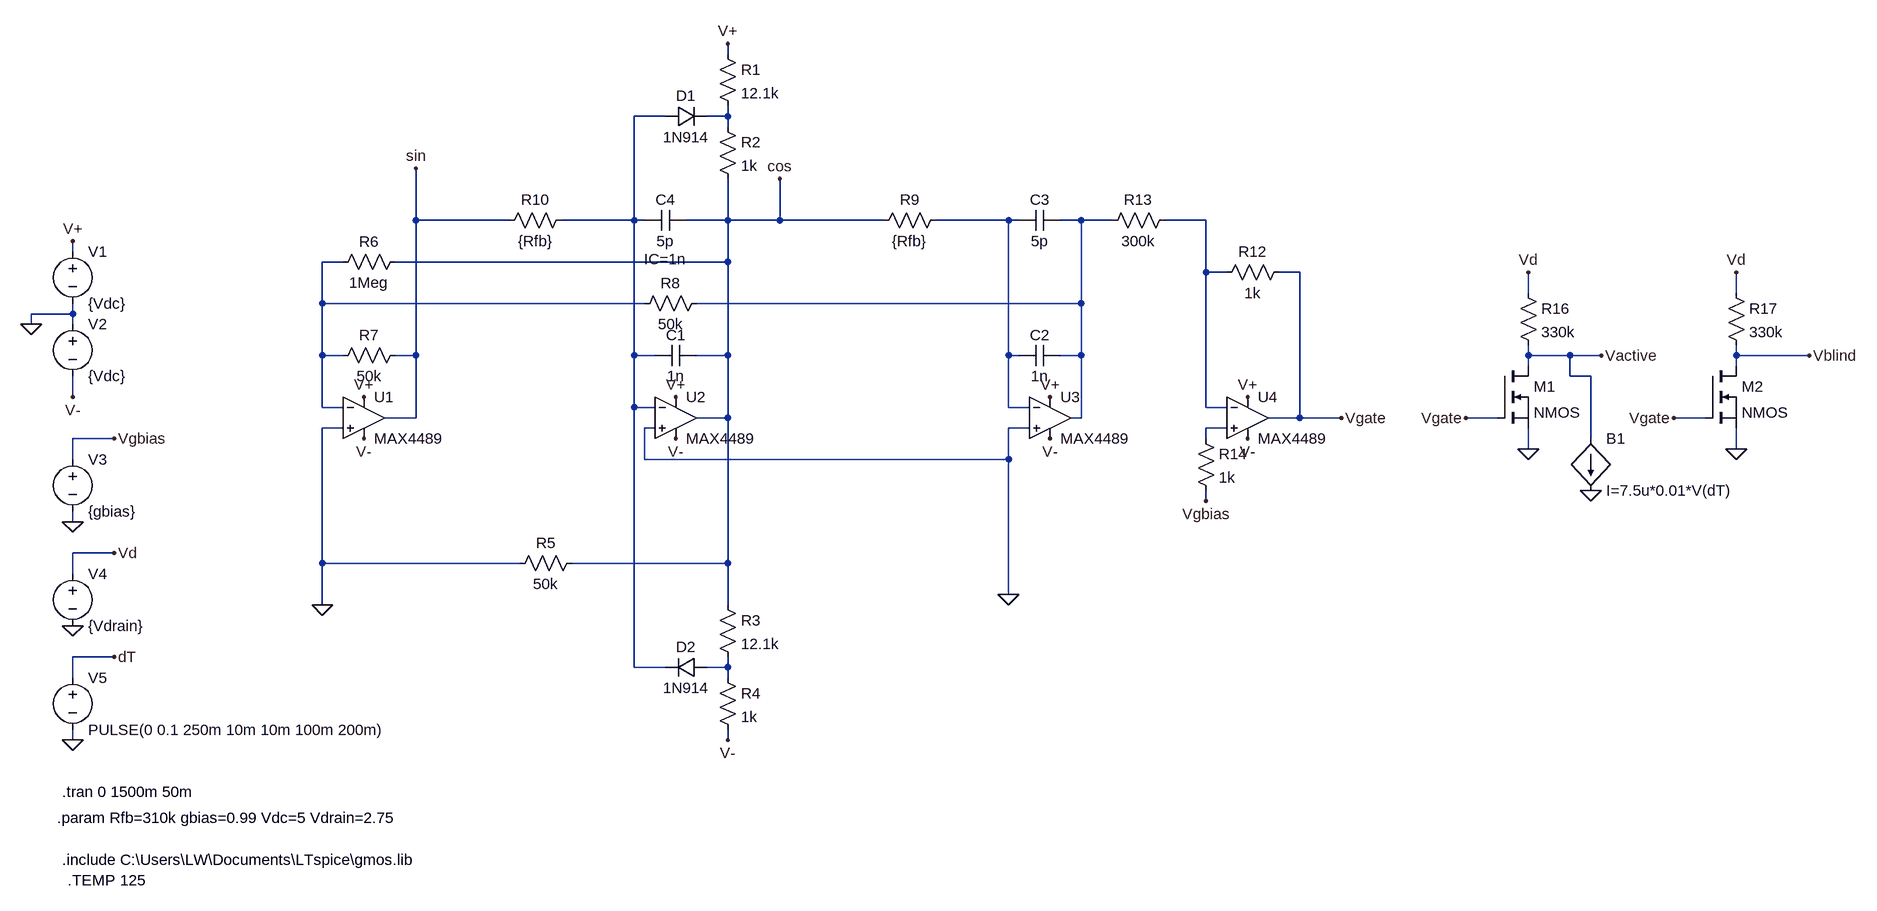
[diagram p0: schematic quadrature_oscillator.asc]
quadrature_oscillator.asc, the LTspice schematic file:
Version 4.1
SHEET 1 2960 2260
WIRE 208 -80 208 -96
WIRE 112 16 64 16
WIRE 208 16 208 0
WIRE 208 16 176 16
WIRE 208 32 208 16
WIRE -272 176 -272 96
WIRE -128 176 -272 176
WIRE 64 176 64 16
WIRE 64 176 -48 176
WIRE 80 176 64 176
WIRE 208 176 208 112
WIRE 208 176 144 176
WIRE 288 176 288 112
WIRE 288 176 208 176
WIRE 448 176 288 176
WIRE 640 176 528 176
WIRE 656 176 640 176
WIRE 752 176 720 176
WIRE 800 176 752 176
WIRE 944 176 880 176
WIRE -800 224 -800 208
WIRE -384 240 -416 240
WIRE 208 240 208 176
WIRE 208 240 -304 240
WIRE 944 256 944 176
WIRE 976 256 944 256
WIRE 1088 256 1056 256
WIRE 1440 288 1440 256
WIRE 1760 288 1760 256
WIRE -416 304 -416 240
WIRE 80 304 -416 304
WIRE 752 304 752 176
WIRE 752 304 160 304
WIRE -800 320 -800 304
WIRE -800 320 -864 320
WIRE -864 336 -864 320
WIRE -800 336 -800 320
WIRE -416 384 -416 304
WIRE -384 384 -416 384
WIRE -272 384 -272 176
WIRE -272 384 -304 384
WIRE 64 384 64 176
WIRE 96 384 64 384
WIRE 208 384 208 240
WIRE 208 384 160 384
WIRE 640 384 640 176
WIRE 656 384 640 384
WIRE 752 384 752 304
WIRE 752 384 720 384
WIRE 1440 384 1440 368
WIRE 1504 384 1440 384
WIRE 1552 384 1504 384
WIRE 1760 384 1760 368
WIRE 1872 384 1760 384
WIRE 1440 400 1440 384
WIRE 1760 400 1760 384
WIRE 1504 416 1504 384
WIRE 1536 416 1504 416
WIRE -800 448 -800 416
WIRE -416 464 -416 384
WIRE -384 464 -416 464
WIRE 64 464 64 384
WIRE 96 464 64 464
WIRE 640 464 640 384
WIRE 672 464 640 464
WIRE 944 464 944 256
WIRE 976 464 944 464
WIRE -272 480 -272 384
WIRE -272 480 -320 480
WIRE 208 480 208 384
WIRE 208 480 160 480
WIRE 752 480 752 384
WIRE 752 480 736 480
WIRE 1088 480 1088 256
WIRE 1088 480 1040 480
WIRE 1152 480 1088 480
WIRE 1392 480 1344 480
WIRE 1712 480 1664 480
WIRE -384 496 -416 496
WIRE 96 496 80 496
WIRE 672 496 640 496
WIRE 976 496 944 496
WIRE -736 512 -800 512
WIRE 944 512 944 496
WIRE 1536 512 1536 416
WIRE 1440 528 1440 496
WIRE 1760 528 1760 496
WIRE -800 544 -800 512
WIRE 80 544 80 496
WIRE 640 544 640 496
WIRE 640 544 80 544
WIRE 944 608 944 592
WIRE -800 640 -800 624
WIRE -736 688 -800 688
WIRE -416 704 -416 496
WIRE -112 704 -416 704
WIRE 208 704 208 480
WIRE 208 704 -32 704
WIRE -800 720 -800 688
WIRE 640 752 640 544
WIRE -416 768 -416 704
WIRE 208 768 208 704
WIRE -736 848 -800 848
WIRE 64 864 64 464
WIRE 112 864 64 864
WIRE 208 864 208 848
WIRE 208 864 176 864
WIRE -800 880 -800 848
WIRE 208 880 208 864
WIRE -800 976 -800 960
WIRE 208 976 208 960
FLAG 208 -96 V+
FLAG 208 976 V-
FLAG 640 752 0
FLAG -272 96 sin
FLAG -416 768 0
FLAG 288 112 cos
FLAG -864 336 0
FLAG -800 448 V-
FLAG -800 208 V+
FLAG -352 448 V+
FLAG 128 448 V+
FLAG 704 448 V+
FLAG -352 512 V-
FLAG 128 512 V-
FLAG 704 512 V-
FLAG 1008 448 V+
FLAG 1008 512 V-
FLAG 1152 480 Vgate
FLAG 944 608 Vgbias
FLAG -800 640 0
FLAG -736 512 Vgbias
FLAG 1440 528 0
FLAG 1440 256 Vd
FLAG 1344 480 Vgate
FLAG 1552 384 Vactive
FLAG -800 800 0
FLAG -736 688 Vd
FLAG 1760 528 0
FLAG 1760 256 Vd
FLAG 1664 480 Vgate
FLAG 1872 384 Vblind
FLAG 1536 592 0
FLAG -800 976 0
FLAG -736 848 dT
SYMBOL res 192 -96 R0
SYMATTR InstName R1
SYMATTR Value 12.1k
SYMBOL res 192 16 R0
SYMATTR InstName R2
SYMATTR Value 1k
SYMBOL diode 112 32 R270
WINDOW 0 32 32 VTop 2
WINDOW 3 0 32 VBottom 2
SYMATTR InstName D1
SYMATTR Value 1N914
SYMBOL res 192 752 R0
SYMATTR InstName R3
SYMATTR Value 12.1k
SYMBOL res 192 864 R0
SYMATTR InstName R4
SYMATTR Value 1k
SYMBOL diode 176 848 R90
WINDOW 0 0 32 VBottom 2
WINDOW 3 32 32 VTop 2
SYMATTR InstName D2
SYMATTR Value 1N914
SYMBOL cap 160 368 R90
WINDOW 0 0 32 VBottom 2
WINDOW 3 32 32 VTop 2
SYMATTR InstName C1
SYMATTR Value 1n
SYMBOL res -16 688 R90
WINDOW 0 0 56 VBottom 2
WINDOW 3 32 56 VTop 2
SYMATTR InstName R5
SYMATTR Value 50k
SYMBOL res -288 224 R90
WINDOW 0 0 56 VBottom 2
WINDOW 3 32 56 VTop 2
SYMATTR InstName R6
SYMATTR Value 1Meg
SYMBOL res -288 368 R90
WINDOW 0 0 56 VBottom 2
WINDOW 3 32 56 VTop 2
SYMATTR InstName R7
SYMATTR Value 50k
SYMBOL res 176 288 R90
WINDOW 0 0 56 VBottom 2
WINDOW 3 32 56 VTop 2
SYMATTR InstName R8
SYMATTR Value 50k
SYMBOL cap 720 368 R90
WINDOW 0 0 32 VBottom 2
WINDOW 3 32 32 VTop 2
SYMATTR InstName C2
SYMATTR Value 1n
SYMBOL res 544 160 R90
WINDOW 0 0 56 VBottom 2
WINDOW 3 32 56 VTop 2
SYMATTR InstName R9
SYMATTR Value {Rfb}
SYMBOL cap 720 160 R90
WINDOW 0 0 32 VBottom 2
WINDOW 3 32 32 VTop 2
SYMATTR InstName C3
SYMATTR Value 5p
SYMBOL res -32 160 R90
WINDOW 0 0 56 VBottom 2
WINDOW 3 32 56 VTop 2
SYMATTR InstName R10
SYMATTR Value {Rfb}
SYMBOL cap 144 160 R90
WINDOW 0 0 32 VBottom 2
WINDOW 3 32 32 VTop 2
WINDOW 39 60 32 VTop 2
SYMATTR InstName C4
SYMATTR Value 5p
SYMATTR SpiceLine IC=1n
SYMBOL voltage -800 208 R0
WINDOW 123 0 0 Left 0
WINDOW 39 0 0 Left 0
SYMATTR InstName V1
SYMATTR Value {Vdc}
SYMBOL voltage -800 320 R0
WINDOW 123 0 0 Left 0
WINDOW 39 0 0 Left 0
SYMATTR InstName V2
SYMATTR Value {Vdc}
SYMBOL OpAmps\\MAX4489 -352 416 R0
SYMATTR InstName U1
SYMBOL OpAmps\\MAX4489 128 416 R0
SYMATTR InstName U2
SYMBOL OpAmps\\MAX4489 704 416 R0
SYMATTR InstName U3
SYMBOL OpAmps\\MAX4489 1008 416 R0
SYMATTR InstName U4
SYMBOL res 1072 240 R90
WINDOW 0 0 56 VBottom 2
WINDOW 3 32 56 VTop 2
SYMATTR InstName R12
SYMATTR Value 1k
SYMBOL res 896 160 R90
WINDOW 0 0 56 VBottom 2
WINDOW 3 32 56 VTop 2
SYMATTR InstName R13
SYMATTR Value 300k
SYMBOL voltage -800 528 R0
WINDOW 123 0 0 Left 0
WINDOW 39 0 0 Left 0
SYMATTR InstName V3
SYMATTR Value {gbias}
SYMBOL res 928 496 R0
SYMATTR InstName R14
SYMATTR Value 1k
SYMBOL nmos 1392 400 R0
SYMATTR InstName M1
SYMBOL res 1424 272 R0
SYMATTR InstName R16
SYMATTR Value 330k
SYMBOL voltage -800 704 R0
WINDOW 123 0 0 Left 0
WINDOW 39 0 0 Left 0
SYMATTR InstName V4
SYMATTR Value {Vdrain}
SYMBOL nmos 1712 400 R0
SYMATTR InstName M2
SYMBOL res 1744 272 R0
SYMATTR InstName R17
SYMATTR Value 330k
SYMBOL bi 1536 512 R0
SYMATTR InstName B1
SYMATTR Value I=7.5u*0.01*V(dT)
SYMBOL voltage -800 864 R0
WINDOW 123 0 0 Left 0
WINDOW 39 0 0 Left 0
SYMATTR InstName V5
SYMATTR Value PULSE(0 0.1 250m 10m 10m 100m 200m)
TEXT -816 1056 Left 2 !.tran 0 1500m 50m
TEXT -824 1096 Left 2 !.param Rfb=310k gbias=0.99 Vdc=5 Vdrain=2.75
TEXT -816 1160 Left 2 !.include C:\\Users\\LW\\Documents\\LTspice\\gmos.lib
TEXT -808 1192 Left 2 !.TEMP 125

The netlist it stands for:
* quadrature_oscillator.asc
R1 V+ N002 12.1k
R2 N002 cos 1k
D1 N001 N002 1N914
R3 cos N008 12.1k
R4 N008 V- 1k
D2 N008 N001 1N914
C1 cos N001 1n
R5 cos 0 50k
R6 cos N006 1Meg
R7 sin N006 50k
R8 N004 N006 50k
C2 N004 N003 1n
R9 N003 cos {Rfb}
C3 N004 N003 5p
R10 N001 sin {Rfb}
C4 cos N001 5p IC=1n
V1 V+ 0 {Vdc}
V2 0 V- {Vdc}
X§U1 0 N006 V+ V- sin MAX4489  ; pins In+ In- V+ V- OUT
X§U2 0 N001 V+ V- cos MAX4489  ; pins In+ In- V+ V- OUT
X§U3 0 N003 V+ V- N004 MAX4489  ; pins In+ In- V+ V- OUT
X§U4 N007 N005 V+ V- Vgate MAX4489  ; pins In+ In- V+ V- OUT
R12 Vgate N005 1k
R13 N005 N004 300k
V3 Vgbias 0 {gbias}
R14 N007 Vgbias 1k
M1 Vactive Vgate 0 0 NMOS
R16 Vd Vactive 330k
V4 Vd 0 {Vdrain}
M2 Vblind Vgate 0 0 NMOS
R17 Vd Vblind 330k
B1 Vactive 0 I=7.5u*0.01*V(dT)
V5 dT 0 PULSE(0 0.1 250m 10m 10m 100m 200m)
.model D D
.lib standard.dio
.model NMOS NMOS
.model PMOS PMOS
.lib standard.mos
.tran 0 1500m 50m
.param Rfb=310k gbias=0.99 Vdc=5 Vdrain=2.75
.include C:\Users\LW\Documents\LTspice\gmos.lib
.TEMP 125
.backanno
.end